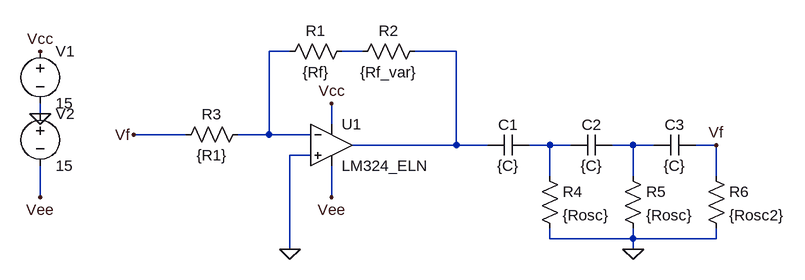
[diagram p0: schematic 1.asc]
1.asc, the LTspice schematic file:
Version 4
SHEET 1 904 680
WIRE 128 -32 96 -32
WIRE 240 -32 208 -32
WIRE 384 -32 320 -32
WIRE -256 64 -256 48
WIRE 192 80 192 48
WIRE -32 96 -112 96
WIRE 96 96 96 -32
WIRE 96 96 48 96
WIRE 160 96 96 96
WIRE 384 112 384 -32
WIRE 384 112 224 112
WIRE 432 112 384 112
WIRE 528 112 496 112
WIRE 560 112 528 112
WIRE 656 112 624 112
WIRE 688 112 656 112
WIRE 784 112 752 112
WIRE 160 128 128 128
WIRE 528 160 528 112
WIRE 656 160 656 112
WIRE 784 160 784 112
WIRE -256 192 -256 144
WIRE 192 192 192 144
WIRE 528 256 528 240
WIRE 656 256 656 240
WIRE 656 256 528 256
WIRE 784 256 784 240
WIRE 784 256 656 256
WIRE 128 272 128 128
WIRE 656 272 656 256
FLAG -256 -32 Vcc
FLAG -256 192 Vee
FLAG -256 64 0
FLAG 128 272 0
FLAG 656 272 0
FLAG 784 112 Vf
FLAG -112 96 Vf
FLAG 192 192 Vee
FLAG 192 48 Vcc
SYMBOL ELN_IFSC\\LM324_ELN 192 112 R0
SYMATTR InstName U1
SYMBOL res 224 -48 R90
WINDOW 0 0 56 VBottom 2
WINDOW 3 32 56 VTop 2
SYMATTR InstName R1
SYMATTR Value {Rf}
SYMBOL res 336 -48 R90
WINDOW 0 0 56 VBottom 2
WINDOW 3 32 56 VTop 2
SYMATTR InstName R2
SYMATTR Value {Rf_var}
SYMBOL voltage -256 -48 R0
WINDOW 123 0 0 Left 0
WINDOW 39 0 0 Left 0
SYMATTR InstName V1
SYMATTR Value 15
SYMBOL voltage -256 48 R0
WINDOW 123 0 0 Left 0
WINDOW 39 0 0 Left 0
SYMATTR InstName V2
SYMATTR Value 15
SYMBOL res 64 80 R90
WINDOW 0 0 56 VBottom 2
WINDOW 3 32 56 VTop 2
SYMATTR InstName R3
SYMATTR Value {R1}
SYMBOL cap 496 96 R90
WINDOW 0 0 32 VBottom 2
WINDOW 3 32 32 VTop 2
SYMATTR InstName C1
SYMATTR Value {C}
SYMBOL cap 624 96 R90
WINDOW 0 0 32 VBottom 2
WINDOW 3 32 32 VTop 2
SYMATTR InstName C2
SYMATTR Value {C}
SYMBOL cap 752 96 R90
WINDOW 0 0 32 VBottom 2
WINDOW 3 32 32 VTop 2
SYMATTR InstName C3
SYMATTR Value {C}
SYMBOL res 512 144 R0
SYMATTR InstName R4
SYMATTR Value {Rosc}
SYMBOL res 640 144 R0
SYMATTR InstName R5
SYMATTR Value {Rosc}
SYMBOL res 768 144 R0
SYMATTR InstName R6
SYMATTR Value {Rosc2}

The netlist it stands for:
* 1.asc
* U1: LM324_ELN (symbol ELN_IFSC\LM324_ELN not available, pins judged from their places): In+=0 In-=N001 V+=Vcc V-=Vee OUT=N003
R1 N002 N001 {Rf}
R2 N003 N002 {Rf_var}
V1 Vcc 0 15
V2 0 Vee 15
R3 N001 Vf {R1}
C1 N004 N003 {C}
C2 N005 N004 {C}
C3 Vf N005 {C}
R4 N004 0 {Rosc}
R5 N005 0 {Rosc}
R6 Vf 0 {Rosc2}
.backanno
.end